# Altium schematic sheet 2.SchDoc
size A3; SheetNumber: 2; SheetTotal: 2
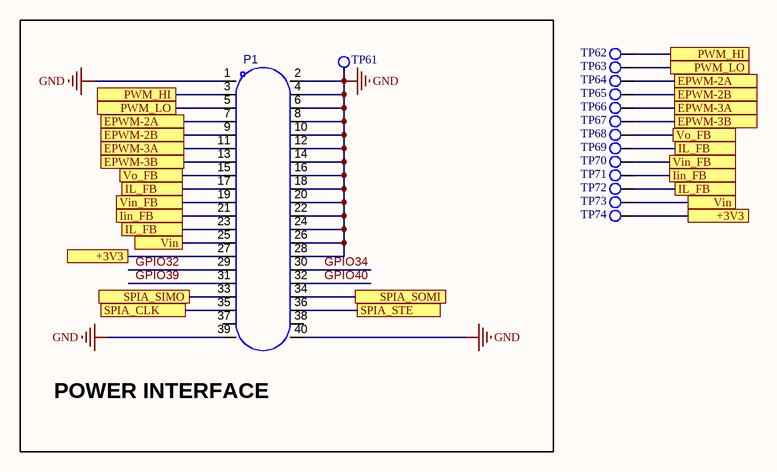
[diagram p0: 2.SchDoc]

## Parts
P1  zx-pm2.54-2-20py  [HDR-TH_40P-P2.54-V-F-R2-C20-S2.54]  (value not drawn)
TP61  TP-pad0.8  [PAD0.8/1.6]  (value not drawn)
TP62  TP-pad0.8  [PAD0.8/1.6]  (value not drawn)
TP63  TP-pad0.8  [PAD0.8/1.6]  (value not drawn)
TP64  TP-pad0.8  [PAD0.8/1.6]  (value not drawn)
TP65  TP-pad0.8  [PAD0.8/1.6]  (value not drawn)
TP66  TP-pad0.8  [PAD0.8/1.6]  (value not drawn)
TP67  TP-pad0.8  [PAD0.8/1.6]  (value not drawn)
TP68  TEST POINT  [TP-1.5]  (value not drawn)
TP69  TEST POINT  [TP-1.5]  (value not drawn)
TP70  TEST POINT  [TP-1.5]  (value not drawn)
TP71  TEST POINT  [TP-1.5]  (value not drawn)
TP72  TEST POINT  [TP-1.5]  (value not drawn)
TP73  TEST POINT  [TP-1.5]  (value not drawn)
TP74  TEST POINT  [TP-1.5]  (value not drawn)

## Blocks framed on the sheet
POWER INTERFACE: P1 TP61

## Ports
+3V3, EPWM-2A, EPWM-2B, EPWM-3A, EPWM-3B, Iin_FB, IL_FB, PWM_HI, PWM_LO, SPIA_CLK, SPIA_SIMO, SPIA_SOMI, SPIA_STE, Vin, Vin_FB, Vo_FB

## Nets
GND: P1.1 P1.2 P1.4 P1.6 P1.8 P1.10 P1.12 P1.14 P1.16 P1.18 P1.20 P1.22 P1.24 P1.26 P1.28 P1.39 P1.40 TP61.1
+3V3: P1.27 TP74.1 ; port +3V3
EPWM-2A: P1.7 TP64.1 ; port EPWM-2A
EPWM-2B: P1.9 TP65.1 ; port EPWM-2B
EPWM-3A: P1.11 TP66.1 ; port EPWM-3A
EPWM-3B: P1.13 TP67.1 ; port EPWM-3B
GPIO32: P1.29
GPIO34: P1.30
GPIO39: P1.31
GPIO40: P1.32
Iin_FB: P1.21 TP71.1 ; port Iin_FB
IL_FB: P1.17 P1.23 TP69.1 TP72.1 ; port IL_FB
PWM_HI: P1.3 TP62.1 ; port PWM_HI
PWM_LO: P1.5 TP63.1 ; port PWM_LO
SPIA_CLK: P1.35 ; port SPIA_CLK
SPIA_SIMO: P1.33 ; port SPIA_SIMO
SPIA_SOMI: P1.34 ; port SPIA_SOMI
SPIA_STE: P1.36 ; port SPIA_STE
Vin: P1.25 TP73.1 ; port Vin
Vin_FB: P1.19 TP70.1 ; port Vin_FB
Vo_FB: P1.15 TP68.1 ; port Vo_FB

Not connected (* = marked no-connect by the designer): P1 37 38

## Library data of the parts
P1 = zx-pm2.54-2-20py: 插孔结构:2x20P;间距:2.54mm;行距:2.54mm;圆孔/方孔:方孔;安装方式:直插;排数:双排;总孔位数:40P;额定电流:3A;额定电压:-;插孔方向:顶部;塑高:8.5mm;触头材质:黄铜;触头镀层:金;工作温度:-40℃~+105℃;; Manufacturer: Megastar(兆星); AddInBom: yes; ModelId: 6c85b3860eb24e43a9d123684eb6d3ee; ModelName: HDR-TH_40P-P2.54-F-LI-2X20P; ModelTransform: 2015.783,196.85,0,0,0,0,0,0,-125.984; Holes Structure: 2x20P; Pitch: 2.54mm; Circular Hole / Square Hole: 方孔; Number of Positions: 40P; Current Rating: 3A; Holes Direction: 顶部; PIN Length: 3.2mm; Symbol: ZX-PM2.54-2-20PY; LCSC Part Name: 2x20P 间距:2.54mm 直插; SupplierPart: C7499354; ManufacturerPart: ZX-PM2.54-2-20PY; Supplier Footprint: 插件,P=2.54mm; JLCPCB Part Class: Extended Part; Datasheet: https://item.szlcsc.com/datasheet/ZX-PM2.54-2-20PY/8574015.html; Supplier: LCSC; ConvertToPcb: yes; FootprintName: HDR-TH_40P-P2.54-V-F-R2-C20-S2.54; Row Spacing: 2.54mm; Mounting Type: 直插; Number of Rows: 双排; Voltage Rating (Max): -; Insulation Height: 8.5mm; Contact Material: 黄铜; Contact Plating: 金; Operating Temperature: -40℃~+105℃